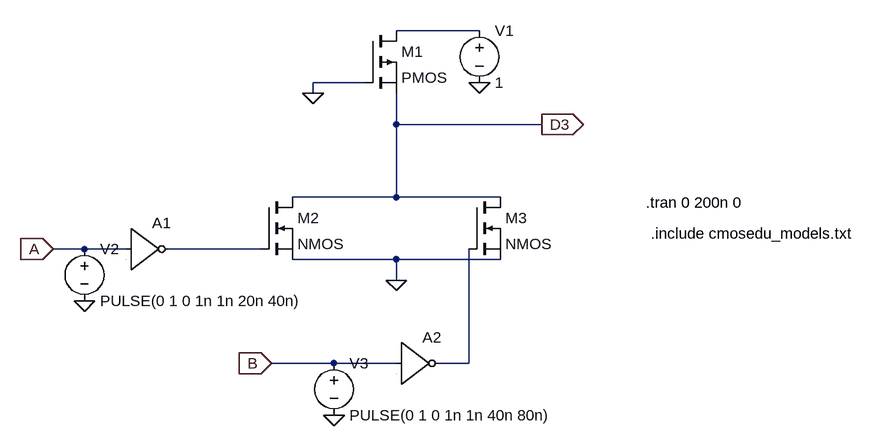
[diagram p0: schematic EXP 8 D3.asc]
EXP 8 D3.asc, the LTspice schematic file:
Version 4
SHEET 1 940 680
WIRE 336 32 208 32
WIRE 160 112 80 112
WIRE 80 128 80 112
WIRE 208 176 208 128
WIRE 432 176 208 176
WIRE 208 288 208 176
WIRE 208 288 48 288
WIRE 368 288 208 288
WIRE -272 368 -320 368
WIRE -208 368 -272 368
WIRE 0 368 -144 368
WIRE 208 384 48 384
WIRE 368 384 208 384
WIRE 208 416 208 384
WIRE 112 544 16 544
WIRE 208 544 112 544
WIRE 320 544 320 368
WIRE 320 544 272 544
FLAG 208 416 0
FLAG 432 176 D3
IOPIN 432 176 Out
FLAG 336 112 0
FLAG 80 128 0
FLAG -320 368 A
IOPIN -320 368 In
FLAG 16 544 B
IOPIN 16 544 In
FLAG -272 448 0
FLAG 112 624 0
SYMBOL pmos 160 32 R0
SYMATTR InstName M1
SYMBOL nmos 0 288 R0
SYMATTR InstName M2
SYMBOL nmos 320 288 R0
SYMATTR InstName M3
SYMBOL voltage 336 16 R0
WINDOW 123 0 0 Left 0
WINDOW 39 0 0 Left 0
SYMATTR InstName V1
SYMATTR Value 1
SYMBOL Digital\\inv -208 304 R0
SYMATTR InstName A1
SYMBOL Digital\\inv 208 480 R0
SYMATTR InstName A2
SYMBOL voltage -272 352 R0
WINDOW 123 0 0 Left 0
WINDOW 39 0 0 Left 0
SYMATTR InstName V2
SYMATTR Value PULSE(0 1 0 1n 1n 20n 40n)
SYMBOL voltage 112 528 R0
WINDOW 123 0 0 Left 0
WINDOW 39 0 0 Left 0
SYMATTR InstName V3
SYMATTR Value PULSE(0 1 0 1n 1n 40n 80n)
TEXT 592 296 Left 2 !.tran 0 200n 0
TEXT 600 344 Left 2 !.include cmosedu_models.txt

The netlist it stands for:
* EXP 8 D3.asc
M1 N001 0 D3 D3 PMOS
M2 D3 N002 0 0 NMOS
M3 D3 N003 0 0 NMOS
V1 N001 0 1
A1 A 0 0 0 0 N002 0 0 BUF
A2 B 0 0 0 0 N003 0 0 BUF
V2 A 0 PULSE(0 1 0 1n 1n 20n 40n)
V3 B 0 PULSE(0 1 0 1n 1n 40n 80n)
.model NMOS NMOS
.model PMOS PMOS
.lib standard.mos
.tran 0 200n 0
.include cmosedu_models.txt
.backanno
.end